# EAGLE schematic serial (EAGLE 7.4.0)
PROJECT_NAME: Serial Daughterboard; REVISION: 0.1

## Sheet 1 of 4
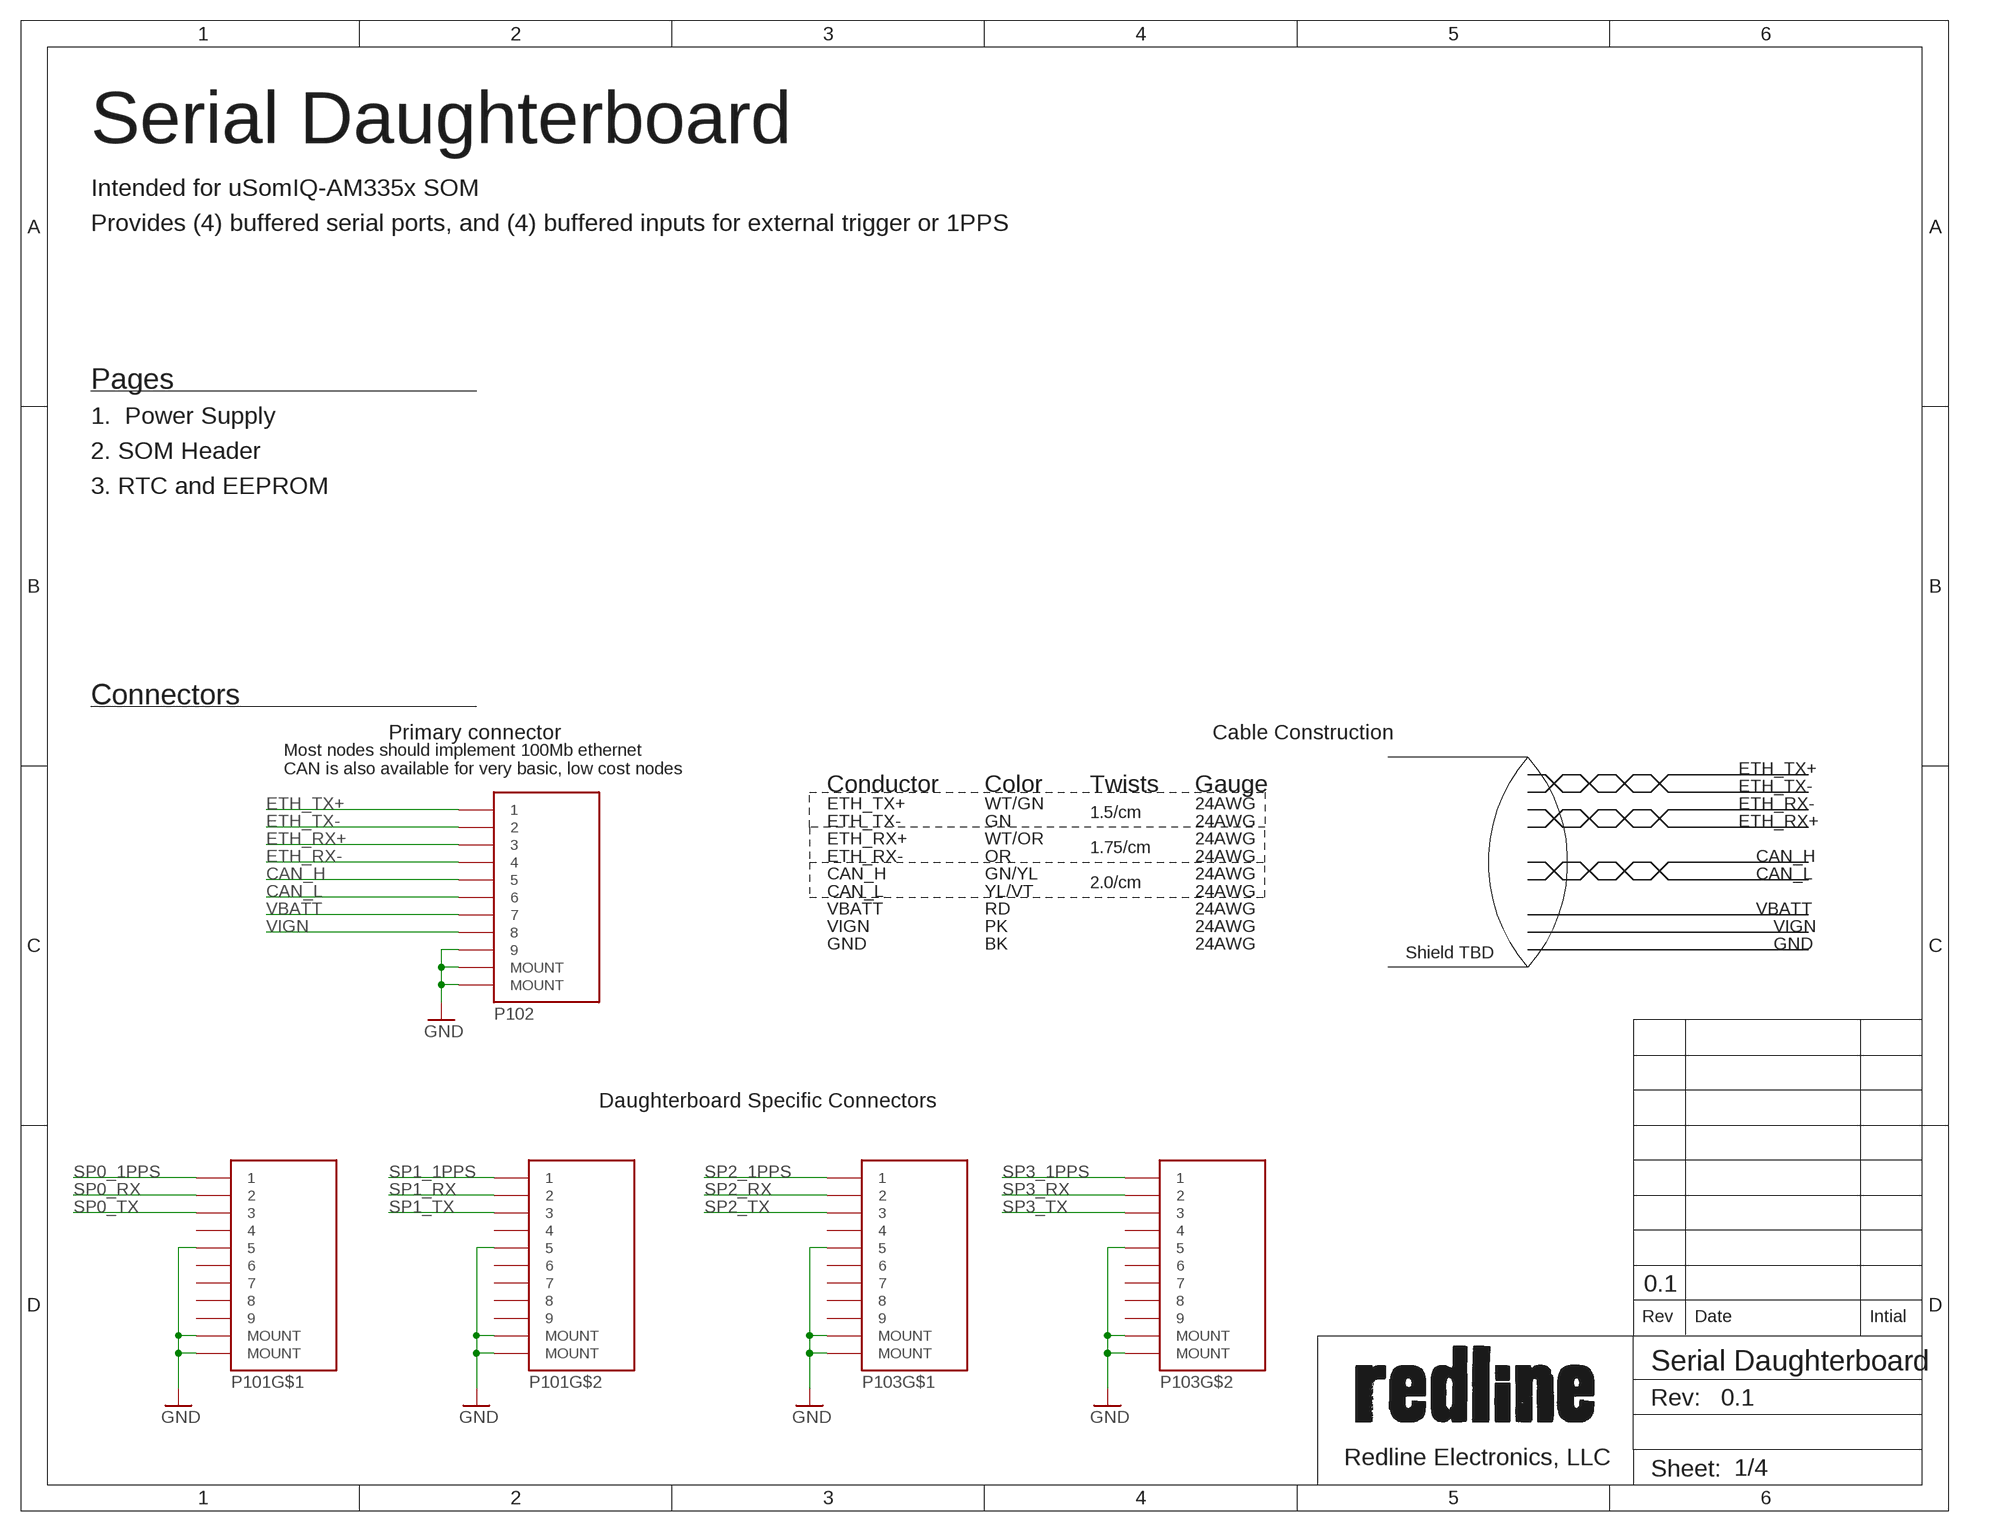
[diagram p0: schematic, sheet 1]

### Parts
P101  189-009-613R571  [189-009-613R571]
P102  83611-9006  [83611-9006]
P103  189-009-613R571  [189-009-613R571]

### Nets
CAN_H: P102.5
CAN_L: P102.6
ETH_RX+: P102.3 ; also sheet 3
ETH_RX-: P102.4 ; also sheet 3
ETH_TX+: P102.1 ; also sheet 3
ETH_TX-: P102.2 ; also sheet 3
GND: P101.A-5 P101.B2 P101.MOUNT@1(MOUNT) P101.MOUNT@2(MOUNT) P101.MOUNT@3(MOUNT) P101.MOUNT@4(MOUNT) P102.9 P102.MOUNT@1(MOUNT) P102.MOUNT@2(MOUNT) P103.A-5 P103.B2 P103.MOUNT@1(MOUNT) P103.MOUNT@2(MOUNT) P103.MOUNT@3(MOUNT) P103.MOUNT@4(MOUNT) ; also sheet 2,3,4
SP0_1PPS: P101.A-1 ; also sheet 4
SP0_RX: P101.A-2 ; also sheet 4
SP0_TX: P101.A-3 ; also sheet 4
SP1_1PPS: P101.B-1 ; also sheet 4
SP1_RX: P101.B-3 ; also sheet 4
SP1_TX: P101.B-4 ; also sheet 4
SP2_1PPS: P103.A-1 ; also sheet 4
SP2_RX: P103.A-2 ; also sheet 4
SP2_TX: P103.A-3 ; also sheet 4
SP3_1PPS: P103.B-1 ; also sheet 4
SP3_RX: P103.B-3 ; also sheet 4
SP3_TX: P103.B-4 ; also sheet 4
VBATT: P102.7 ; also sheet 2
VIGN: P102.8 ; also sheet 2
Unconnected: P101.A-4 P101.A-6 P101.A-7 P101.A-8 P101.A-9 P101.B-5 P101.P$1 P101.P$2 P101.P$3 P101.P$4 P103.A-4 P103.A-6 P103.A-7 P103.A-8 P103.A-9 P103.B-5 P103.P$1 P103.P$2 P103.P$3 P103.P$4

### Notes on the sheet
- Serial Daughterboard
- Intended for uSomIQ-AM335x SOM
- Provides (4) buffered serial ports, and (4) buffered inputs for external trigger or 1PPS
- Pages
- 1.  Power Supply
- 2. SOM Header
- 3. RTC and EEPROM
- Connectors
- Primary connector | Cable Construction
- Most nodes should implement 100Mb ethernet
  CAN is also available for very basic, low cost nodes
- ETH_TX+
- Conductor | Color | Twists | Gauge | ETH_TX-
- ETH_TX+ | WT/GN | 24AWG | ETH_RX-
- 1.5/cm
- ETH_TX- | GN | 24AWG | ETH_RX+
- ETH_RX+ | WT/OR | 24AWG
- 1.75/cm
- ETH_RX- | OR | 24AWG | CAN_H
- CAN_H | GN/YL | 24AWG | CAN_L
- 2.0/cm
- CAN_L | YL/VT | 24AWG
- VBATT | RD | 24AWG | VBATT
- VIGN | PK | 24AWG | VIGN
- GND | BK | 24AWG | GND
- Shield TBD
- Daughterboard Specific Connectors
- 0.1

## Sheet 2 of 4
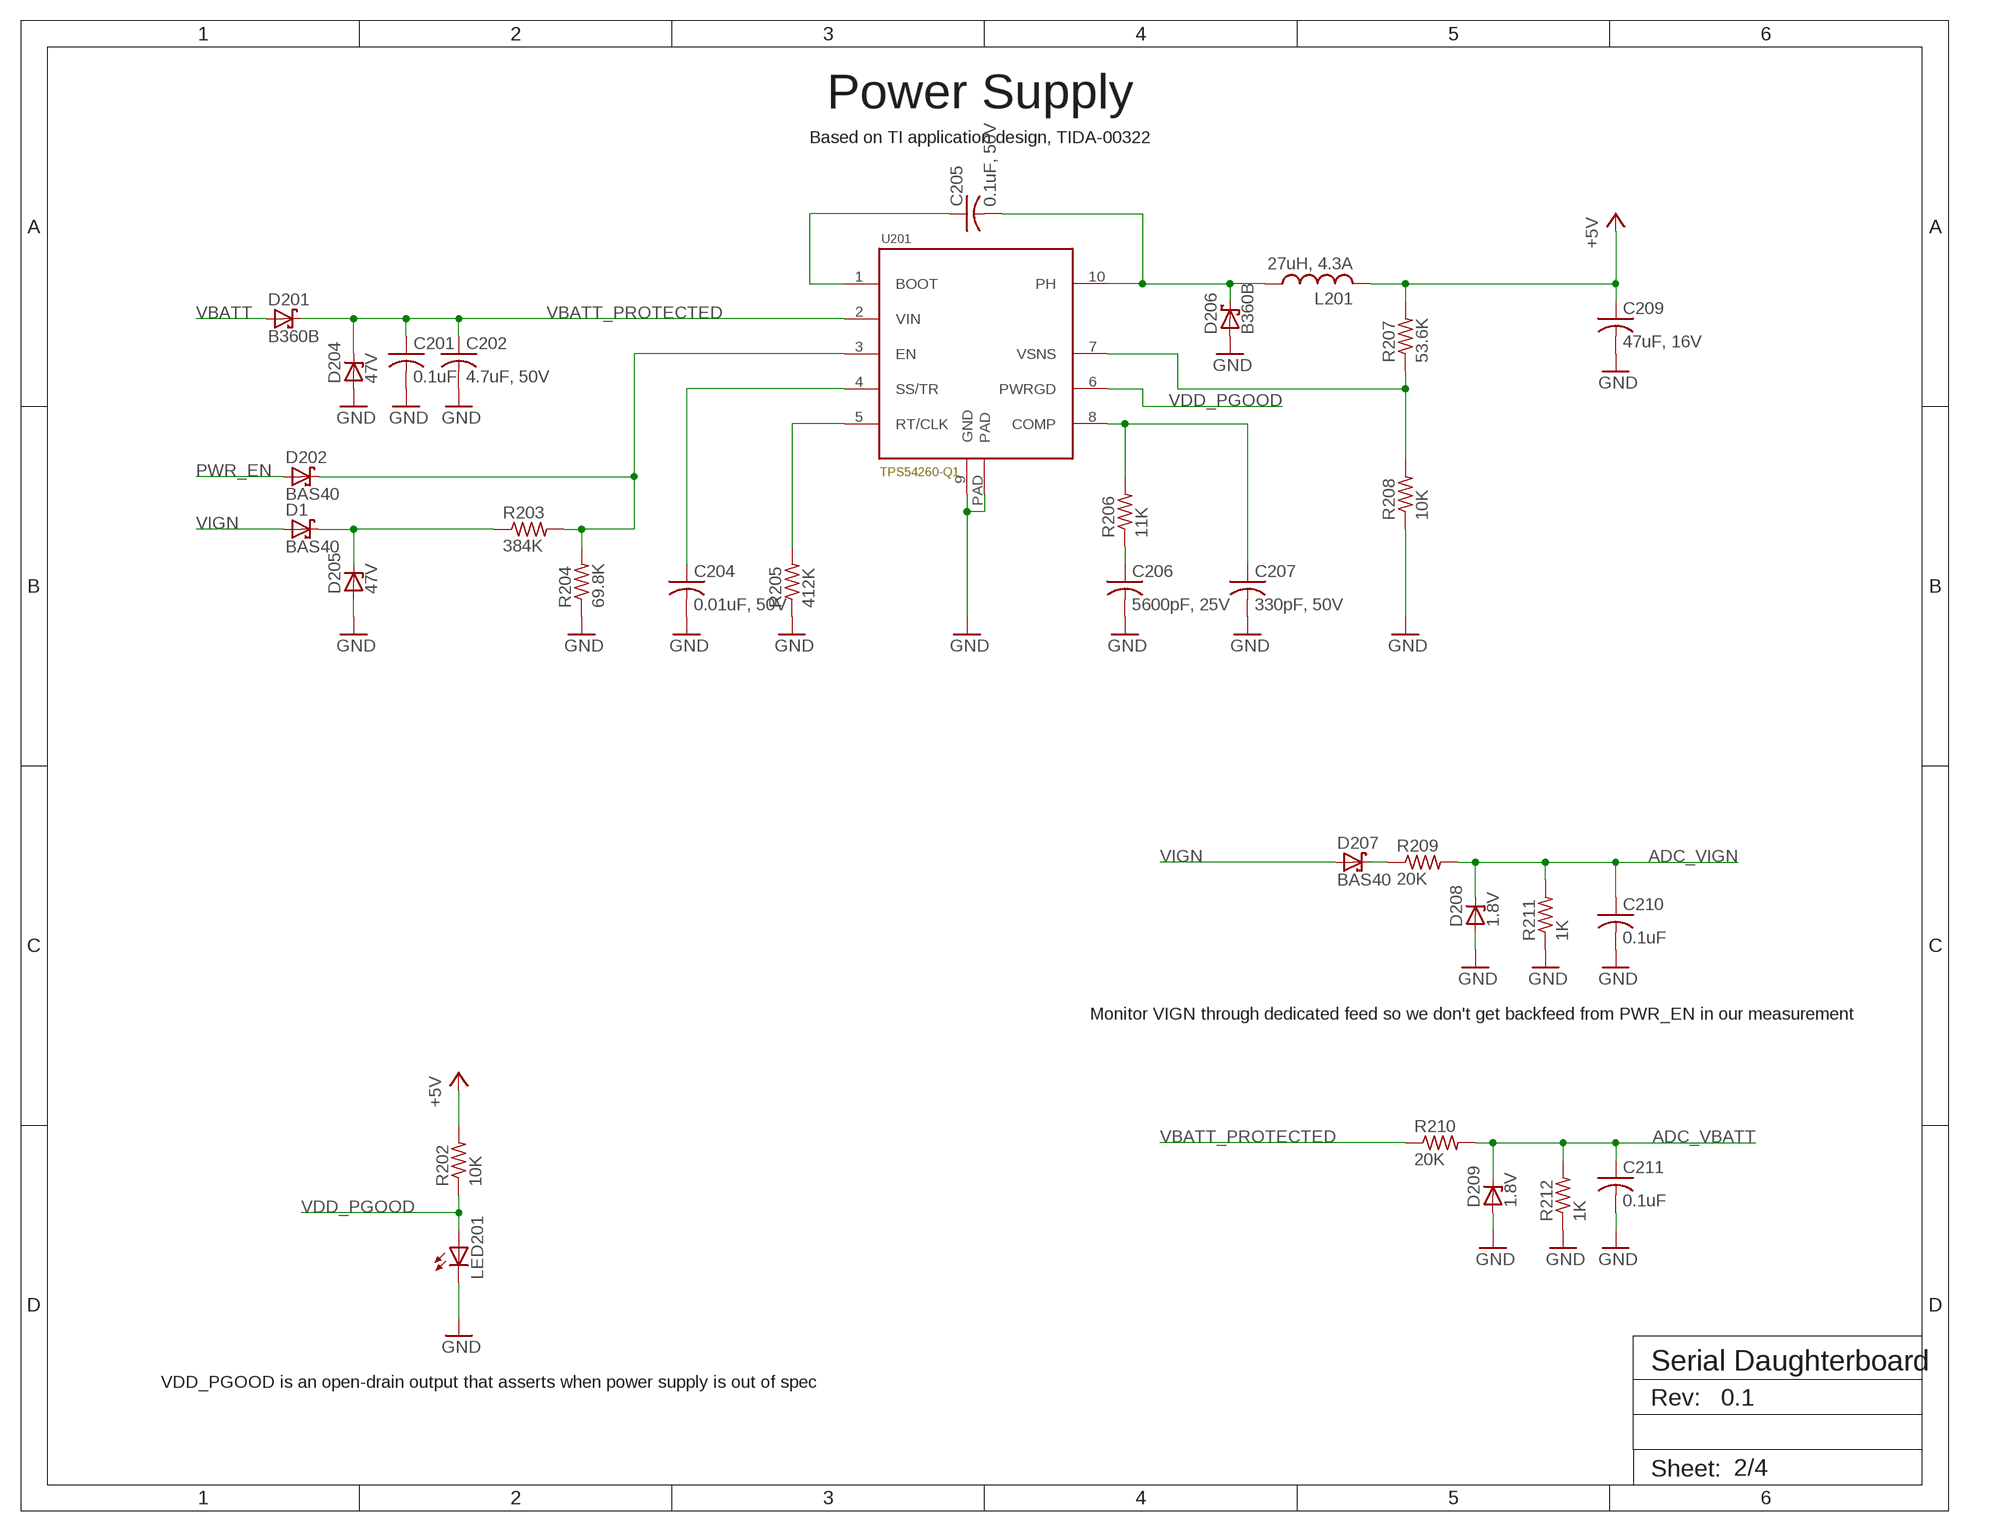
[diagram p1: schematic, sheet 2]

### Parts
C201  0.1uF  C-USC1210  [C1210]
C202  4.7uF, 50V  C-USC1210  [C1210]
C204  0.01uF, 50V  C-USC0603  [C0603]
C205  0.1uF, 50V  C-USC0603  [C0603]
C206  5600pF, 25V  C-USC0603  [C0603]
C207  330pF, 50V  C-USC0603  [C0603]
C209  47uF, 16V  C-USC2220K  [C2220K]
C210  0.1uF  C-USC0603  [C0603]
C211  0.1uF  C-USC0603  [C0603]
D1  BAS40  [SOT23]
D201  B360B  SCHOTTKY-DIODESMD  [SMB]
D202  BAS40  [SOT23]
D204  47V  ZENER-DIODESMB  [SMB]
D205  47V  ZENER-DIODESOT23  [SOT23]
D206  B360B  SCHOTTKY-DIODESMD  [SMB]
D207  BAS40  [SOT23]
D208  1.8V  ZENER-DIODESOT23  [SOT23]
D209  1.8V  ZENER-DIODESOT23  [SOT23]
L201  27uH, 4.3A  L-US  [7447798271]
LED201  LEDSML0603  [SML0603]
R202  10K  R-US_R0603  [R0603]
R203  384K  R-US_R0603  [R0603]
R204  69.8K  R-US_R0603  [R0603]
R205  412K  R-US_R0603  [R0603]
R206  11K  R-US_R0603  [R0603]
R207  53.6K  R-US_R0603  [R0603]
R208  10K  R-US_R0603  [R0603]
R209  20K  R-US_R0603  [R0603]
R210  20K  R-US_R0603  [R0603]
R211  1K  R-US_R0603  [R0603]
R212  1K  R-US_R0603  [R0603]
U201  TPS54260  [S-PDSO-G10]

### Nets
+5V: C209.1 L201.P$2 R202.2 R207.2 ; also sheet 3
ADC_VBATT: C211.1 D209.3(C) R210.2 R212.2 ; also sheet 3
ADC_VIGN: C210.1 D208.3(C) R209.2 R211.2 ; also sheet 3
GND: C201.2 C202.2 C204.2 C206.2 C207.2 C209.2 C210.2 C211.2 D204.A D205.1(A) D206.A D208.1(A) D209.1(A) LED201.C R204.1 R205.1 R208.1 R211.1 R212.1 U201.9(GND) U201.PAD ; also sheet 1,3,4
N$2: C204.1 U201.4(SS/TR)
N$3: D1.3(C) D205.3(C) R203.1
N$4: D202.3(C) R203.2 R204.2 U201.3(EN)
N$5: R205.2 U201.5(RT/CLK)
N$6: C205.1 U201.1(BOOT)
N$7: C205.2 D206.C L201.P$1 U201.10(PH)
N$9: R207.1 R208.2 U201.7(VSNS)
N$10: C207.1 R206.2 U201.8(COMP)
N$11: C206.1 R206.1
N$42: D207.3(C) R209.1
PWR_EN: D202.1(A) ; also sheet 3
VBATT: D201.A ; also sheet 1
VBATT_PROTECTED: C201.1 C202.1 D201.C D204.C R210.1 U201.2(VIN)
VDD_PGOOD: LED201.A R202.1 U201.6(PWRGD)
VIGN: D1.1(A) D207.1(A) ; also sheet 1

### Notes on the sheet
- Power Supply
- Based on TI application design, TIDA-00322
- Monitor VIGN through dedicated feed so we don't get backfeed from PWR_EN in our measurement
- VDD_PGOOD is an open-drain output that asserts when power supply is out of spec

## Sheet 3 of 4
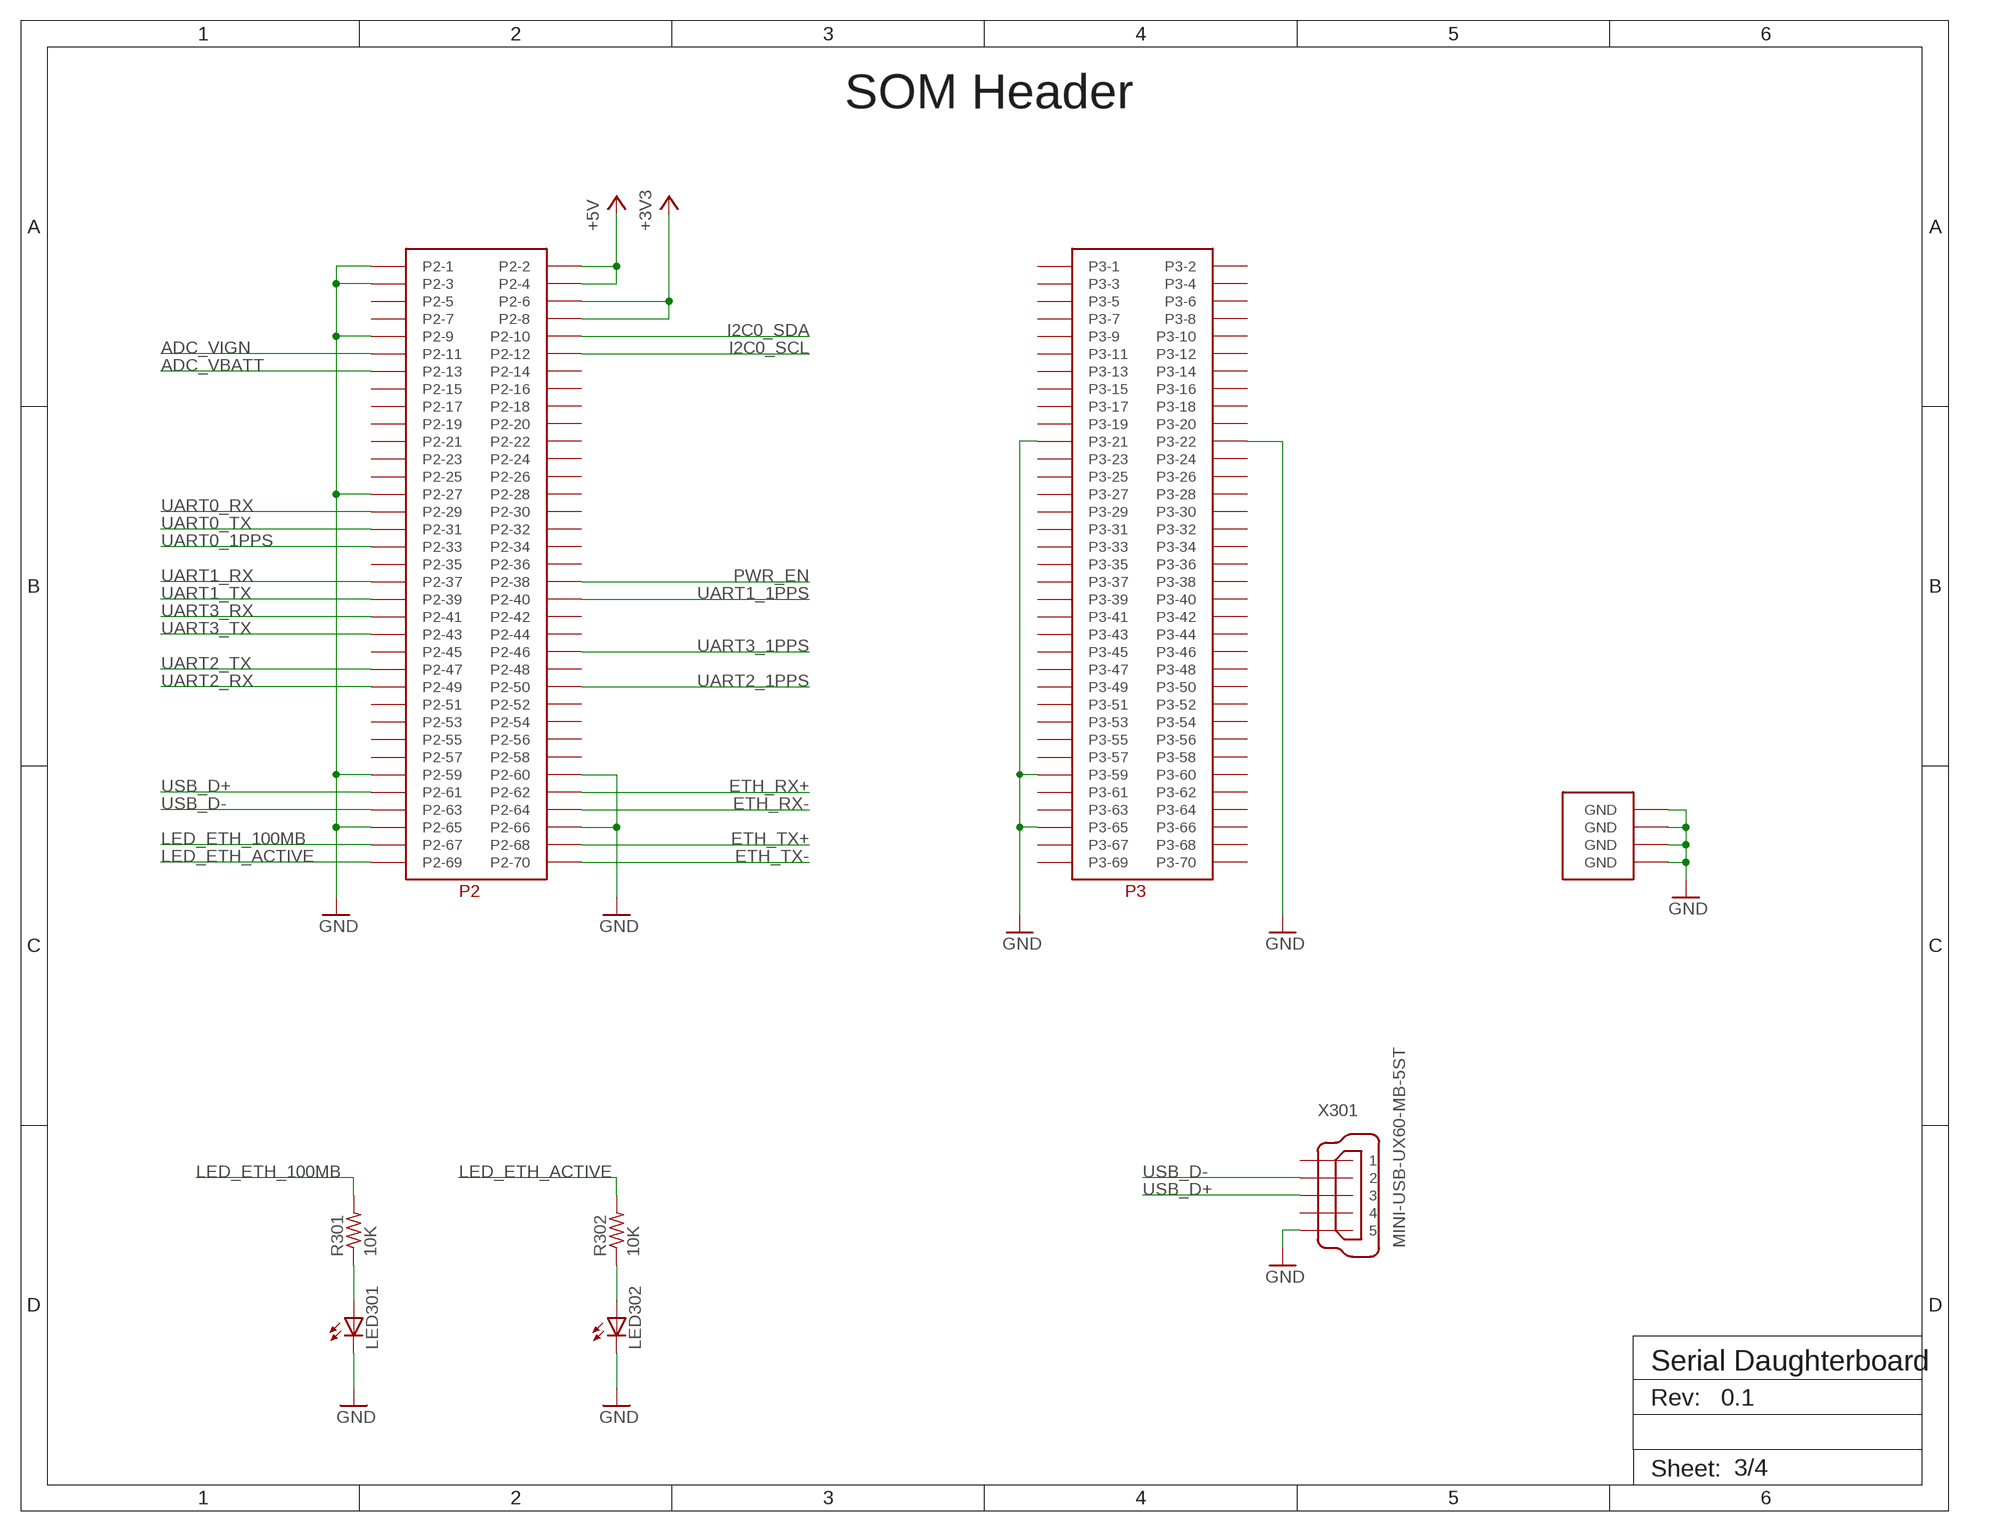
[diagram p2: schematic, sheet 3]

### Parts
LED301  LEDSML0603  [SML0603]
LED302  LEDSML0603  [SML0603]
P301  USOMIQ-AM335X  [USOMIQ-AM335X]
R301  10K  R-US_R0603  [R0603]
R302  10K  R-US_R0603  [R0603]
X301  MINI-USB-UX60-MB-5ST  [UX60-MB-5ST]

### Nets
+3V3: P301.P$6(P2-6) P301.P$8(P2-8) ; also sheet 4
+5V: P301.P$2(P2-2) P301.P$4(P2-4) ; also sheet 2
ADC_VBATT: P301.P$13(P2-13) ; also sheet 2
ADC_VIGN: P301.P$11(P2-11) ; also sheet 2
ETH_RX+: P301.P$62(P2-62) ; also sheet 1
ETH_RX-: P301.P$64(P2-64) ; also sheet 1
ETH_TX+: P301.P$68(P2-68) ; also sheet 1
ETH_TX-: P301.P$70(P2-70) ; also sheet 1
GND: LED301.C LED302.C P301.MOUNT@0(GND) P301.MOUNT@1(GND) P301.MOUNT@2(GND) P301.MOUNT@3(GND) P301.P$1(P2-1) P301.P$3(P2-3) P301.P$9(P2-9) P301.P$27(P2-27) P301.P$59(P2-59) P301.P$60(P2-60) P301.P$65(P2-65) P301.P$66(P2-66) P301.P$91(P3-21) P301.P$92(P3-22) P301.P$129(P3-59) P301.P$135(P3-65) X301.5 ; also sheet 1,2,4
I2C0_SCL: P301.P$12(P2-12) ; also sheet 4
I2C0_SDA: P301.P$10(P2-10) ; also sheet 4
LED_ETH_100MB: P301.P$67(P2-67) R301.2
LED_ETH_ACTIVE: P301.P$69(P2-69) R302.2
PWR_EN: P301.P$38(P2-38) ; also sheet 2
UART0_1PPS: P301.P$33(P2-33) ; also sheet 4
UART0_RX: P301.P$29(P2-29) ; also sheet 4
UART0_TX: P301.P$31(P2-31) ; also sheet 4
UART1_1PPS: P301.P$40(P2-40) ; also sheet 4
UART1_RX: P301.P$37(P2-37) ; also sheet 4
UART1_TX: P301.P$39(P2-39) ; also sheet 4
UART2_1PPS: P301.P$50(P2-50) ; also sheet 4
UART2_RX: P301.P$49(P2-49) ; also sheet 4
UART2_TX: P301.P$47(P2-47) ; also sheet 4
UART3_1PPS: P301.P$46(P2-46) ; also sheet 4
UART3_RX: P301.P$41(P2-41) ; also sheet 4
UART3_TX: P301.P$43(P2-43) ; also sheet 4
USB_D+: P301.P$61(P2-61) X301.3
USB_D-: P301.P$63(P2-63) X301.2
VDD_PGOOD1: LED301.A R301.1
VDD_PGOOD2: LED302.A R302.1
Unconnected: P301.P$5(P2-5) P301.P$7(P2-7) P301.P$14(P2-14) P301.P$15(P2-15) P301.P$16(P2-16) P301.P$17(P2-17) P301.P$18(P2-18) P301.P$19(P2-19) P301.P$20(P2-20) P301.P$21(P2-21) P301.P$22(P2-22) P301.P$23(P2-23) P301.P$24(P2-24) P301.P$25(P2-25) P301.P$26(P2-26) P301.P$28(P2-28) P301.P$30(P2-30) P301.P$32(P2-32) P301.P$34(P2-34) P301.P$35(P2-35) P301.P$36(P2-36) P301.P$42(P2-42) P301.P$44(P2-44) P301.P$45(P2-45) P301.P$48(P2-48) P301.P$51(P2-51) P301.P$52(P2-52) P301.P$53(P2-53) P301.P$54(P2-54) P301.P$55(P2-55) P301.P$56(P2-56) P301.P$57(P2-57) P301.P$58(P2-58) P301.P$71(P3-1) P301.P$72(P3-2) P301.P$73(P3-3) P301.P$74(P3-4) P301.P$75(P3-5) P301.P$76(P3-6) P301.P$77(P3-7) P301.P$78(P3-8) P301.P$79(P3-9) P301.P$80(P3-10) P301.P$81(P3-11) P301.P$82(P3-12) P301.P$83(P3-13) P301.P$84(P3-14) P301.P$85(P3-15) P301.P$86(P3-16) P301.P$87(P3-17) P301.P$88(P3-18) P301.P$89(P3-19) P301.P$90(P3-20) P301.P$93(P3-23) P301.P$94(P3-24) P301.P$95(P3-25) P301.P$96(P3-26) P301.P$97(P3-27) P301.P$98(P3-28) P301.P$99(P3-29) P301.P$100(P3-30) P301.P$101(P3-31) P301.P$102(P3-32) P301.P$103(P3-33) P301.P$104(P3-34) P301.P$105(P3-35) P301.P$106(P3-36) P301.P$107(P3-37) P301.P$108(P3-38) P301.P$109(P3-39) P301.P$110(P3-40) P301.P$111(P3-41) P301.P$112(P3-42) P301.P$113(P3-43) P301.P$114(P3-44) P301.P$115(P3-45) P301.P$116(P3-46) P301.P$117(P3-47) P301.P$118(P3-48) P301.P$119(P3-49) P301.P$120(P3-50) P301.P$121(P3-51) P301.P$122(P3-52) P301.P$123(P3-53) P301.P$124(P3-54) P301.P$125(P3-55) P301.P$126(P3-56) P301.P$127(P3-57) P301.P$128(P3-58) P301.P$130(P3-60) P301.P$131(P3-61) P301.P$132(P3-62) P301.P$133(P3-63) P301.P$134(P3-64) P301.P$136(P3-66) P301.P$137(P3-67) P301.P$138(P3-68) P301.P$139(P3-69) P301.P$140(P3-70) X301.1 X301.4

### Notes on the sheet
- SOM Header

## Sheet 4 of 4
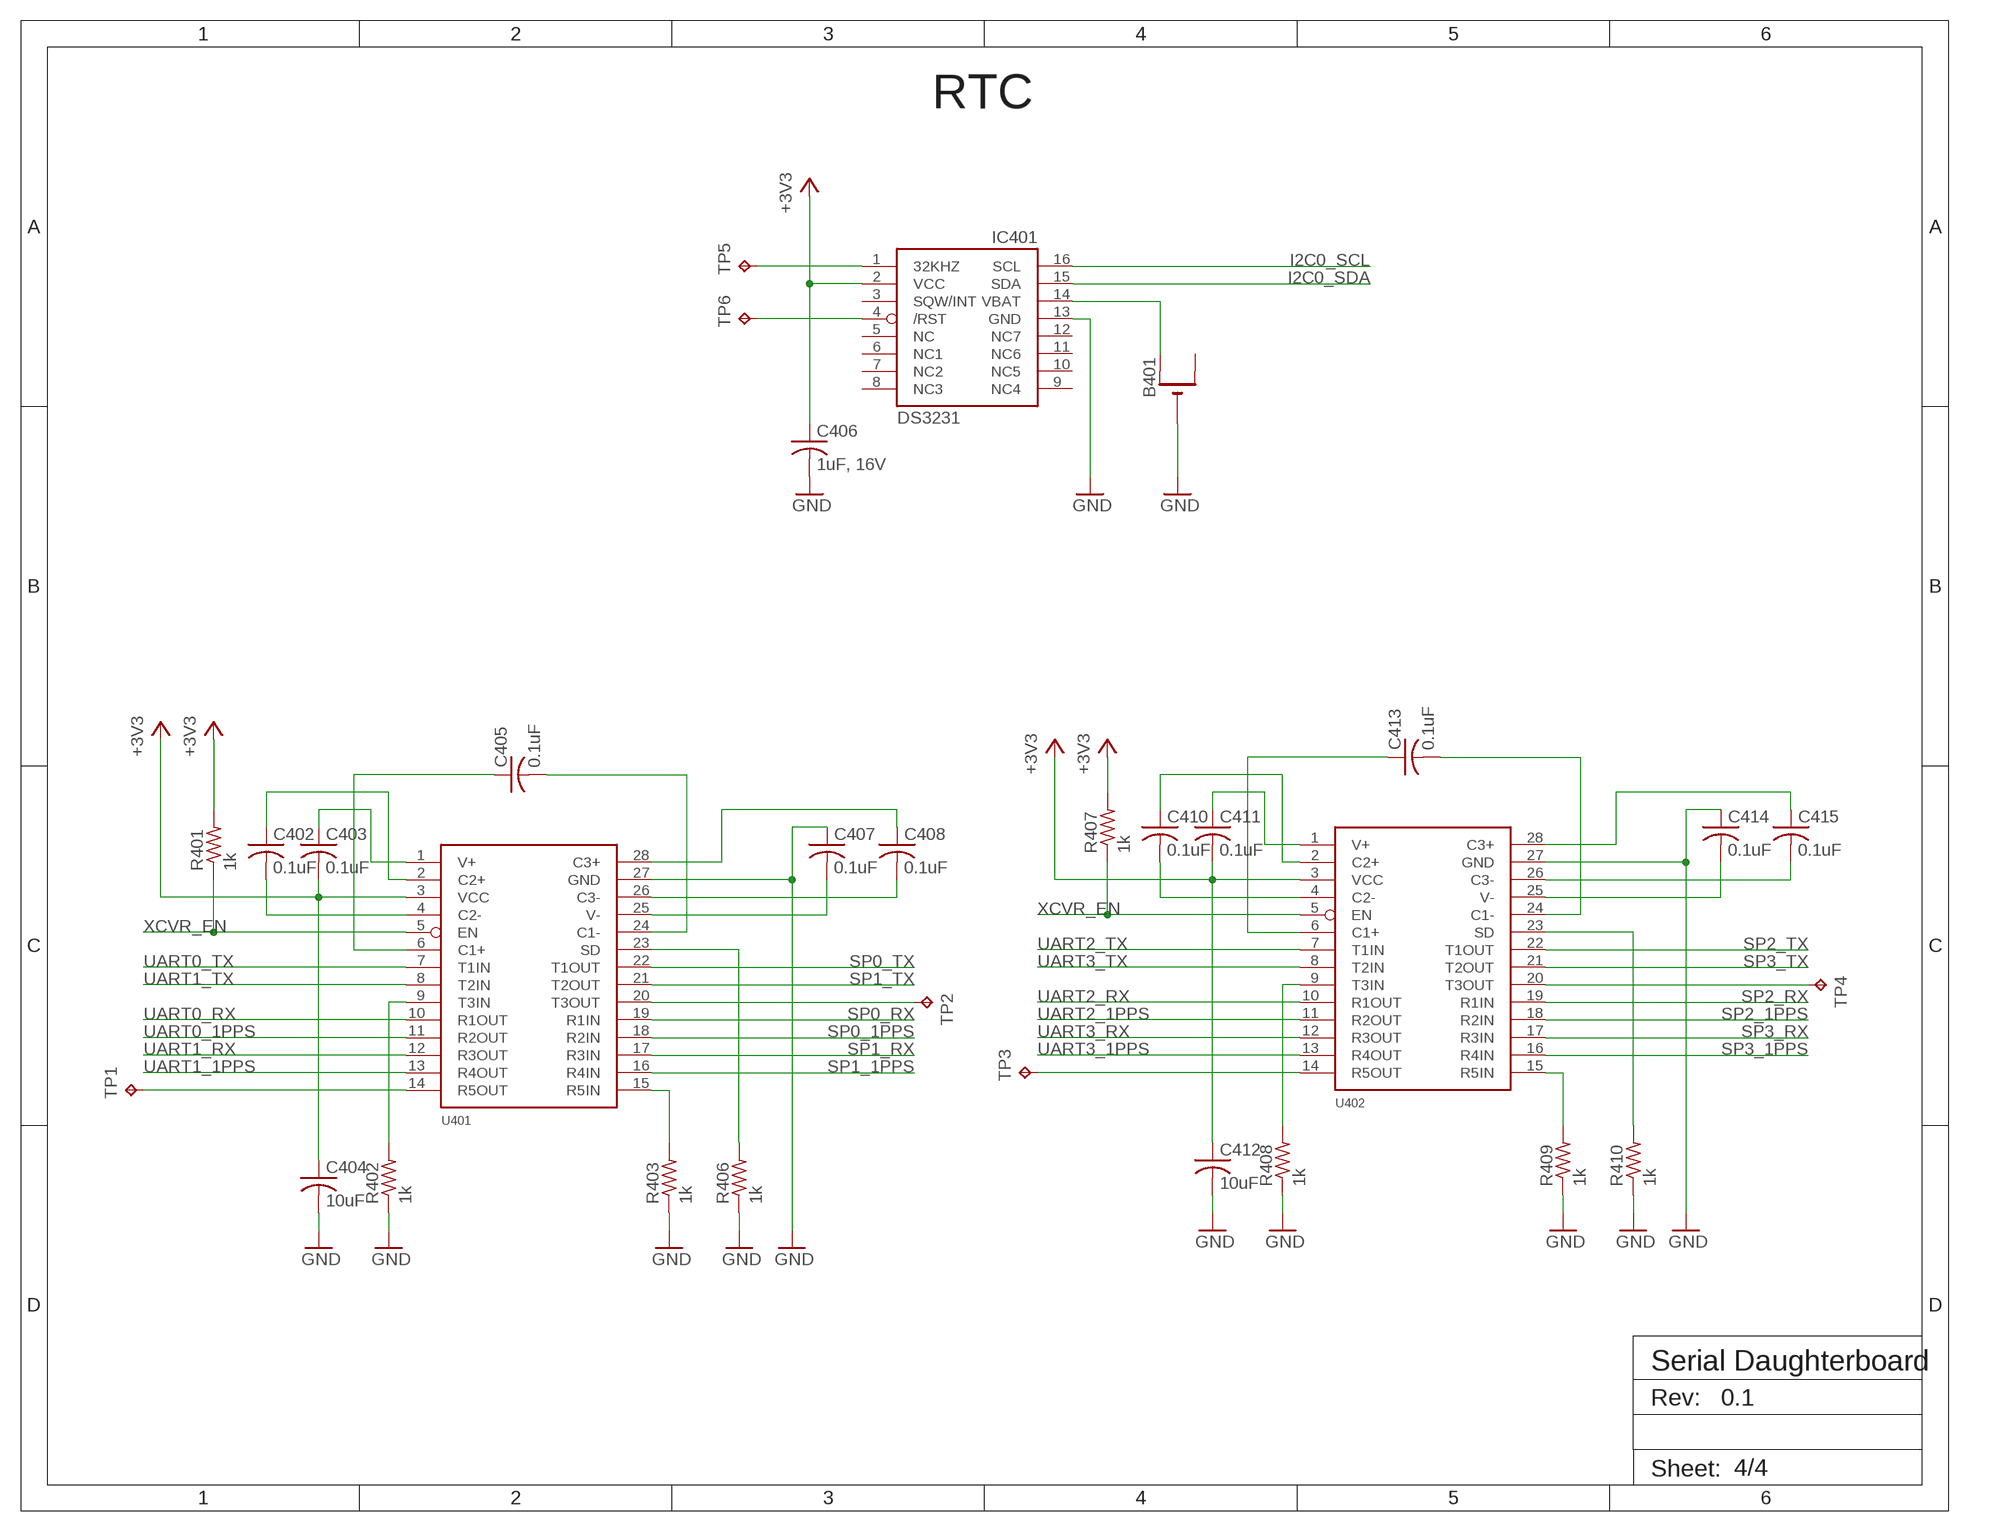
[diagram p3: schematic, sheet 4]

### Parts
B401  CR1220THM  [CR1220-THM]
C402  0.1uF  C-USC0603  [C0603]
C403  0.1uF  C-USC0603  [C0603]
C404  10uF  C-USC0603  [C0603]
C405  0.1uF  C-USC0603  [C0603]
C406  1uF, 16V  C-USC0603  [C0603]
C407  0.1uF  C-USC0603  [C0603]
C408  0.1uF  C-USC0603  [C0603]
C410  0.1uF  C-USC0603  [C0603]
C411  0.1uF  C-USC0603  [C0603]
C412  10uF  C-USC0603  [C0603]
C413  0.1uF  C-USC0603  [C0603]
C414  0.1uF  C-USC0603  [C0603]
C415  0.1uF  C-USC0603  [C0603]
IC401  DS3231/SO  [SO16W]
R401  1k  R-US_R0603  [R0603]
R402  1k  R-US_R0603  [R0603]
R403  1k  R-US_R0603  [R0603]
R406  1k  R-US_R0603  [R0603]
R407  1k  R-US_R0603  [R0603]
R408  1k  R-US_R0603  [R0603]
R409  1k  R-US_R0603  [R0603]
R410  1k  R-US_R0603  [R0603]
TP1  TPB1,27  [B1,27]
TP2  TPB1,27  [B1,27]
TP3  TPB1,27  [B1,27]
TP4  TPB1,27  [B1,27]
TP5  TPB1,27  [B1,27]
TP6  TPB1,27  [B1,27]
U401  ADM3311E  [TSSOP28]
U402  ADM3311E  [TSSOP28]

### Nets
+3V3: C403.2 C404.1 C406.1 C411.2 C412.1 IC401.2(VCC) R401.2 R407.2 U401.3(VCC) U402.3(VCC) ; also sheet 3
GND: B401.- C404.2 C406.2 C407.1 C412.2 C414.1 IC401.13(GND) R402.1 R403.1 R406.1 R408.1 R409.1 R410.1 U401.27(GND) U402.27(GND) ; also sheet 1,2,3
I2C0_SCL: IC401.16(SCL) ; also sheet 3
I2C0_SDA: IC401.15(SDA) ; also sheet 3
N$8: IC401.1(32KHZ) TP5.TP
N$12: B401.+1(+) IC401.14(VBAT)
N$13: C403.1 U401.1(V+)
N$14: C411.1 U402.1(V+)
N$15: C402.1 U401.2(C2+)
N$16: C402.2 U401.4(C2-)
N$17: R402.2 U401.9(T3IN)
N$18: TP1.TP U401.14(R5OUT)
N$19: TP2.TP U401.20(T3OUT)
N$20: R403.2 U401.15(R5IN)
N$21: R406.2 U401.23(SD)
N$22: C405.1 U401.6(C1+)
N$23: C405.2 U401.24(C1-)
N$24: C407.2 U401.25(V-)
N$25: C410.1 U402.2(C2+)
N$26: C408.2 U401.26(C3-)
N$27: C408.1 U401.28(C3+)
N$28: C410.2 U402.4(C2-)
N$29: R408.2 U402.9(T3IN)
N$30: TP3.TP U402.14(R5OUT)
N$31: TP4.TP U402.20(T3OUT)
N$32: R409.2 U402.15(R5IN)
N$33: R410.2 U402.23(SD)
N$34: C413.1 U402.6(C1+)
N$35: C413.2 U402.24(C1-)
N$36: C414.2 U402.25(V-)
N$37: C415.2 U402.26(C3-)
N$38: C415.1 U402.28(C3+)
N$39: IC401.4(/RST) TP6.TP
SP0_1PPS: U401.18(R2IN) ; also sheet 1
SP0_RX: U401.19(R1IN) ; also sheet 1
SP0_TX: U401.22(T1OUT) ; also sheet 1
SP1_1PPS: U401.16(R4IN) ; also sheet 1
SP1_RX: U401.17(R3IN) ; also sheet 1
SP1_TX: U401.21(T2OUT) ; also sheet 1
SP2_1PPS: U402.18(R2IN) ; also sheet 1
SP2_RX: U402.19(R1IN) ; also sheet 1
SP2_TX: U402.22(T1OUT) ; also sheet 1
SP3_1PPS: U402.16(R4IN) ; also sheet 1
SP3_RX: U402.17(R3IN) ; also sheet 1
SP3_TX: U402.21(T2OUT) ; also sheet 1
UART0_1PPS: U401.11(R2OUT) ; also sheet 3
UART0_RX: U401.10(R1OUT) ; also sheet 3
UART0_TX: U401.7(T1IN) ; also sheet 3
UART1_1PPS: U401.13(R4OUT) ; also sheet 3
UART1_RX: U401.12(R3OUT) ; also sheet 3
UART1_TX: U401.8(T2IN) ; also sheet 3
UART2_1PPS: U402.11(R2OUT) ; also sheet 3
UART2_RX: U402.10(R1OUT) ; also sheet 3
UART2_TX: U402.7(T1IN) ; also sheet 3
UART3_1PPS: U402.13(R4OUT) ; also sheet 3
UART3_RX: U402.12(R3OUT) ; also sheet 3
UART3_TX: U402.8(T2IN) ; also sheet 3
XCVR_EN: R401.1 R407.1 U401.5(EN) U402.5(EN)
Unconnected: B401.+2(+1) IC401.3(SQW/INT) IC401.5(NC) IC401.6(NC1) IC401.7(NC2) IC401.8(NC3) IC401.9(NC4) IC401.10(NC5) IC401.11(NC6) IC401.12(NC7)

### Notes on the sheet
- RTC

## Library data of the parts
B401 = adafruit:CR1220: CR1216/CR1220/CR1225 12mm 3V lithium coin cell Great for battery packup. Both SMT and THM holders. Note the THM package has the ground pads on both sides of the PCB so that the masks are the same - this reduces the cost
C201 C202 C204-C207 C209-C211 C406 = rcl:C-US: CAPACITOR, American symbol
C402-C405 C407 C408 C410-C415 = resistor:C-US: CAPACITOR, American symbol
D1 D202 D207 = diode:BAS40: Silicon Schottky Diodes General-purpose diode for high-speed switching
D201 D206 = diode:SCHOTTKY-DIODE: Schottky Diode
D204 D205 D208 D209 = diode:ZENER-DIODE: Z-Diode
IC401 = adafruit:DS3231
L201 = power-supplies:L-US: INDUCTOR, American symbol
LED201 LED301 LED302 = led:LED: LED OSRAM: - CHIPLED LG R971, LG N971, LY N971, LG Q971, LY Q971, LO R971, LY R971 LH N974, LH R974 LS Q976, LO Q976, LY Q976 LO Q996 - Hyper CHIPLED LW Q18S LB Q993, LB Q99A, LB R99A - SideLED LS A670, LO A670, LY A670, LG A670, LP A670 LB A673, LV A673, LT A673, LW A673 LH A674 LY A675 LS A676, LA A676, LO A676, LY A676, LW A676 LS A679, LY A679, LG A679 - Hyper Micro SIDELED® LS Y876, LA Y876, LO Y876, LY Y876 LT Y87S - SmartLED LW L88C, LW L88S LB L89C, LB L89S, LG L890 LS L89K, LO L89K, LY L89K LS L896, LA L896, LO L896, LY L896 - TOPLED LS T670, LO T670, LY T670, LG T670, LP T670 LSG T670, LSP T670, LSY T670, LOP T670, LYG T670 LG T671, LOG T671, LSG T671 LB T673, LV T673, LT T673, LW T673 LH T674 LS T676, LA T676, LO T676, LY T676, LB T676, LH T676, LSB T676, LW T676 LB T67C, LV T67C, LT T67C, LS T67K, LO T67K, LY T67K, LW E67C LS E67B, LA E67B, LO E67B, LY E67B, LB E67C, LV E67C, LT E67C LW T67C LS T679, LY T679, LG T679 LS T770, LO T770, LY T770, LG T770, LP T770 LB T773, LV T773, LT T773, LW T773 LH T774 LS E675, LA E675, LY E675, LS T675 LS T776, LA T776, LO T776, LY T776, LB T776 LHGB T686 LT T68C, LB T68C - Hyper Mini TOPLED® LB M676 - Mini TOPLED Santana® LG M470 LS M47K, LO M47K, LY M47K Source: http://www.osram.convergy.de LUXEON: - LUMILED® LXK2-PW12-R00, LXK2-PW12-S00, LXK2-PW14-U00, LXK2-PW14-V00 LXK2-PM12-R00, LXK2-PM12-S00, LXK2-PM14-U00 LXK2-PE12-Q00, LXK2-PE12-R00, LXK2-PE12-S00, LXK2-PE14-T00, LXK2-PE14-U00 LXK2-PB12-K00, LXK2-PB12-L00, LXK2-PB12-M00, LXK2-PB14-N00, LXK2-PB14-P00, LXK2-PB14-Q00 LXK2-PR12-L00, LXK2-PR12-M00, LXK2-PR14-Q00, LXK2-PR14-R00 LXK2-PD12-Q00, LXK2-PD12-R00, LXK2-PD12-S00 LXK2-PH12-R00, LXK2-PH12-S00 LXK2-PL12-P00, LXK2-PL12-Q00, LXK2-PL12-R00 Source: www.luxeon.com KINGBRIGHT: KA-3528ASYC Source: www.kingbright.com
P101 P103 = connectors:189-009-613R571
P102 = connectors:83611-9006
P301 = connectors:USOMIQ-AM335X
R202-R212 R301 R302 = rcl:R-US_: RESISTOR, American symbol
R401-R403 R406-R410 = resistor:R-US_: RESISTOR, American symbol
TP1-TP6 = testpad:TP: Test pad
U201 = power-supplies:TPS54260
U401 U402 = misc-ics:ADM3311E
X301 = con-hirose:MINI-USB-: MINI USB Connector Source: http://www.hirose.co.jp/cataloge_hp/e24000019.pdf; OC_FARNELL: unknown; OC_NEWARK: unknown